# EAGLE design mother_board (EAGLE 5.11)
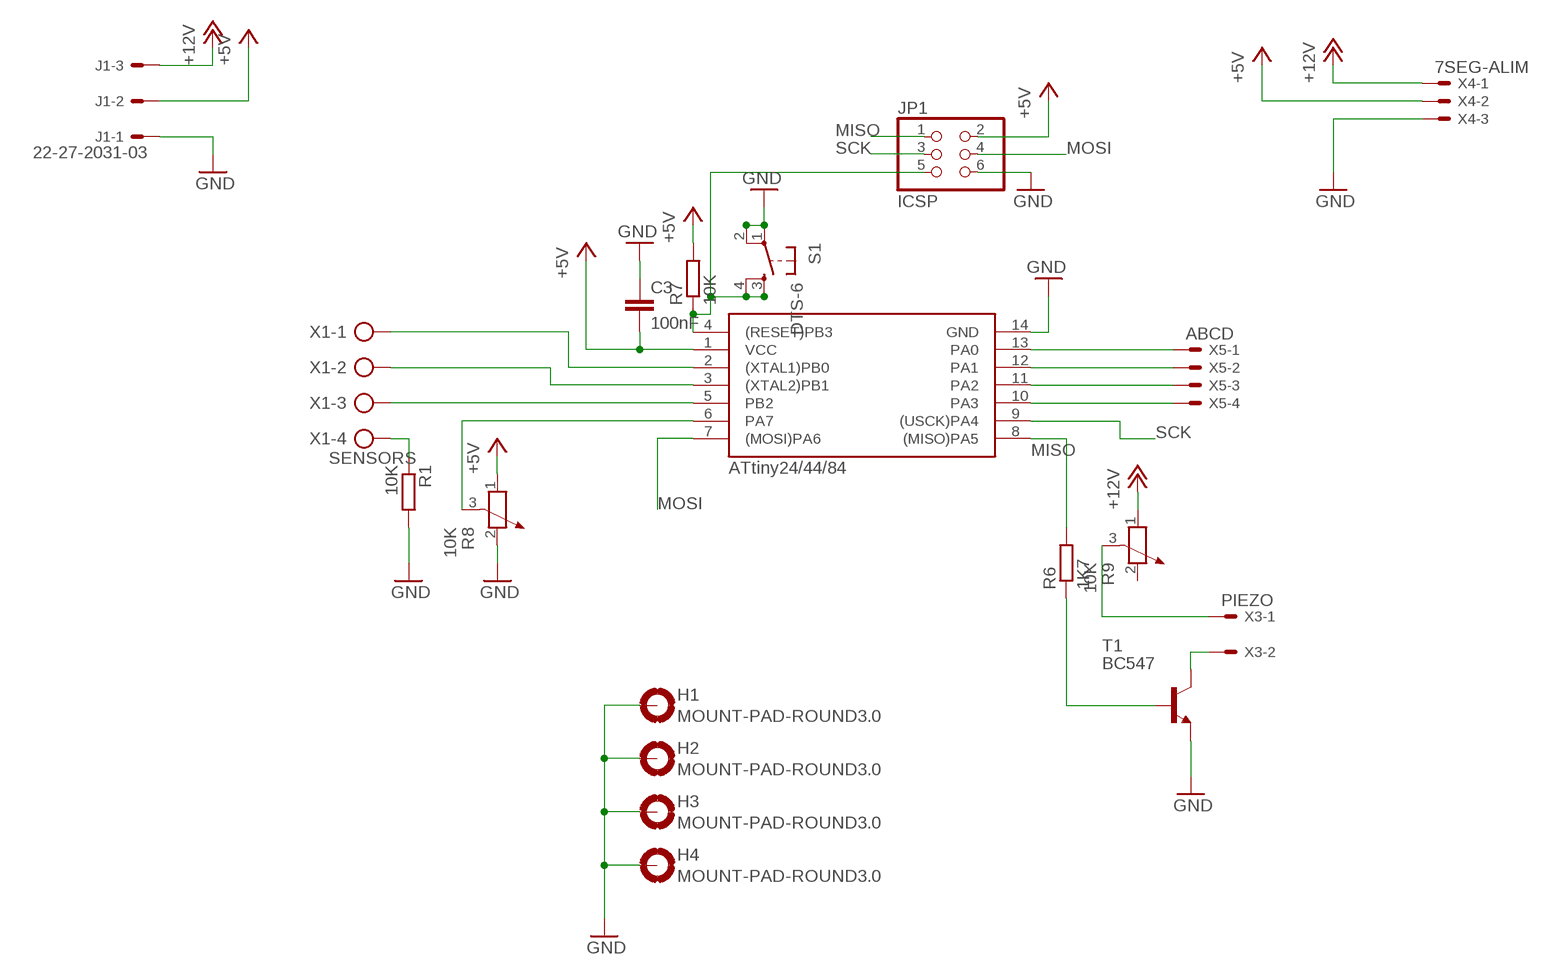
[diagram p0: schematic, sheet 1]

## Parts
C3  100nF  C-EU025-025X050  [C025-025X050]
H1  MOUNT-PAD-ROUND3.0  [3,0-PAD]
H2  MOUNT-PAD-ROUND3.0  [3,0-PAD]
H3  MOUNT-PAD-ROUND3.0  [3,0-PAD]
H4  MOUNT-PAD-ROUND3.0  [3,0-PAD]
J1  22-27-2031-03  [6410-03]
JP1  ICSP  PINHD-2X3  [2X03]
R1  10K  R-EU_0207/10  [0207/10]
R6  1K7  R-EU_0207/10  [0207/10]
R7  10K  R-EU_0207/10  [0207/10]
R8  10K  POTENTIOMETER_PT-10  [PT-10]
R9  10K  POTENTIOMETER_PT-10  [PT-10]
S1  DTS-6  [DTS-6]
T1  BC547  [TO92]
U$1  TINY24/44/84  [DIL14]
X1  SENSORS  AK500/4  [AK500/4]
X3  PIEZO  22-27-2021-02  [6410-02]
X4  7SEG-ALIM  22-27-2031-03  [6410-03]
X5  ABCD  22-27-2041-04  [6410-04]

## Nets
+5V [alim]: C3.2 J1.2 JP1.2 R7.2 R8.1 U$1.1(VCC) X4.2
+12V [alim]: J1.3 R9.1 X4.1
GND [alim]: C3.1 H1.B3,0(MOUNT) H2.B3,0(MOUNT) H3.B3,0(MOUNT) H4.B3,0(MOUNT) J1.1 JP1.6 R1.2 R8.2 S1.1 S1.2 T1.1(E) U$1.14(GND) X4.3
MISO: JP1.1 R6.2 U$1.8((MISO)PA5)
MOSI: JP1.4 U$1.7((MOSI)PA6)
N$1: R9.3 X3.1
N$2: R8.3 U$1.6(PA7)
N$3: U$1.5(PB2) X1.3
N$4: R1.1 X1.4
N$7: U$1.2((XTAL1)PB0) X1.1
N$8: R6.1 T1.2(B)
N$9: T1.3(C) X3.2
N$11: U$1.3((XTAL2)PB1) X1.2
N$12: U$1.13(PA0) X5.1
N$13: U$1.12(PA1) X5.2
N$14: U$1.11(PA2) X5.3
N$15: U$1.10(PA3) X5.4
N$20: JP1.5 R7.1 S1.3 S1.4 U$1.4((RESET)PB3)
SCK: JP1.3 U$1.9((USCK)PA4)
Unconnected: R9.2

## Library data of the parts
C3 = rcl:C-EU: CAPACITOR, European symbol
H1-H4 = holes:MOUNT-PAD-ROUND: MOUNTING PAD, round
J1 X4 = con-molex:22-?-03: CONNECTOR wire to board 2.54 mm (.1 inch) pitch header; OC_FARNELL: unknown; OC_NEWARK: unknown
JP1 = pinhead:PINHD-2X3: PIN HEADER
R1 R6 R7 = resistor:R-EU_: RESISTOR, European symbol
R8 R9 = rcl:POTENTIOMETER_: Potentiometer
S1 = switch-tact:DTS-6
T1 = transistor:BC547: NPN TRANSISTOR
U$1 = atmel_misc:TINY24/44/84
X1 = con-ptr500:AK500/4: CONNECTOR; OC_FARNELL: unknown; OC_NEWARK: unknown
X3 = con-molex:22-?-02: CONNECTOR wire to board 2.54 mm (.1 inch) pitch header; OC_FARNELL: unknown; OC_NEWARK: unknown
X5 = con-molex:22-?-04: CONNECTOR wire to board 2.54 mm (.1 inch) pitch header; OC_FARNELL: unknown; OC_NEWARK: unknown

## Net classes
0 default: width 0.813 mm
1 alim: width 1.27 mm

## Board
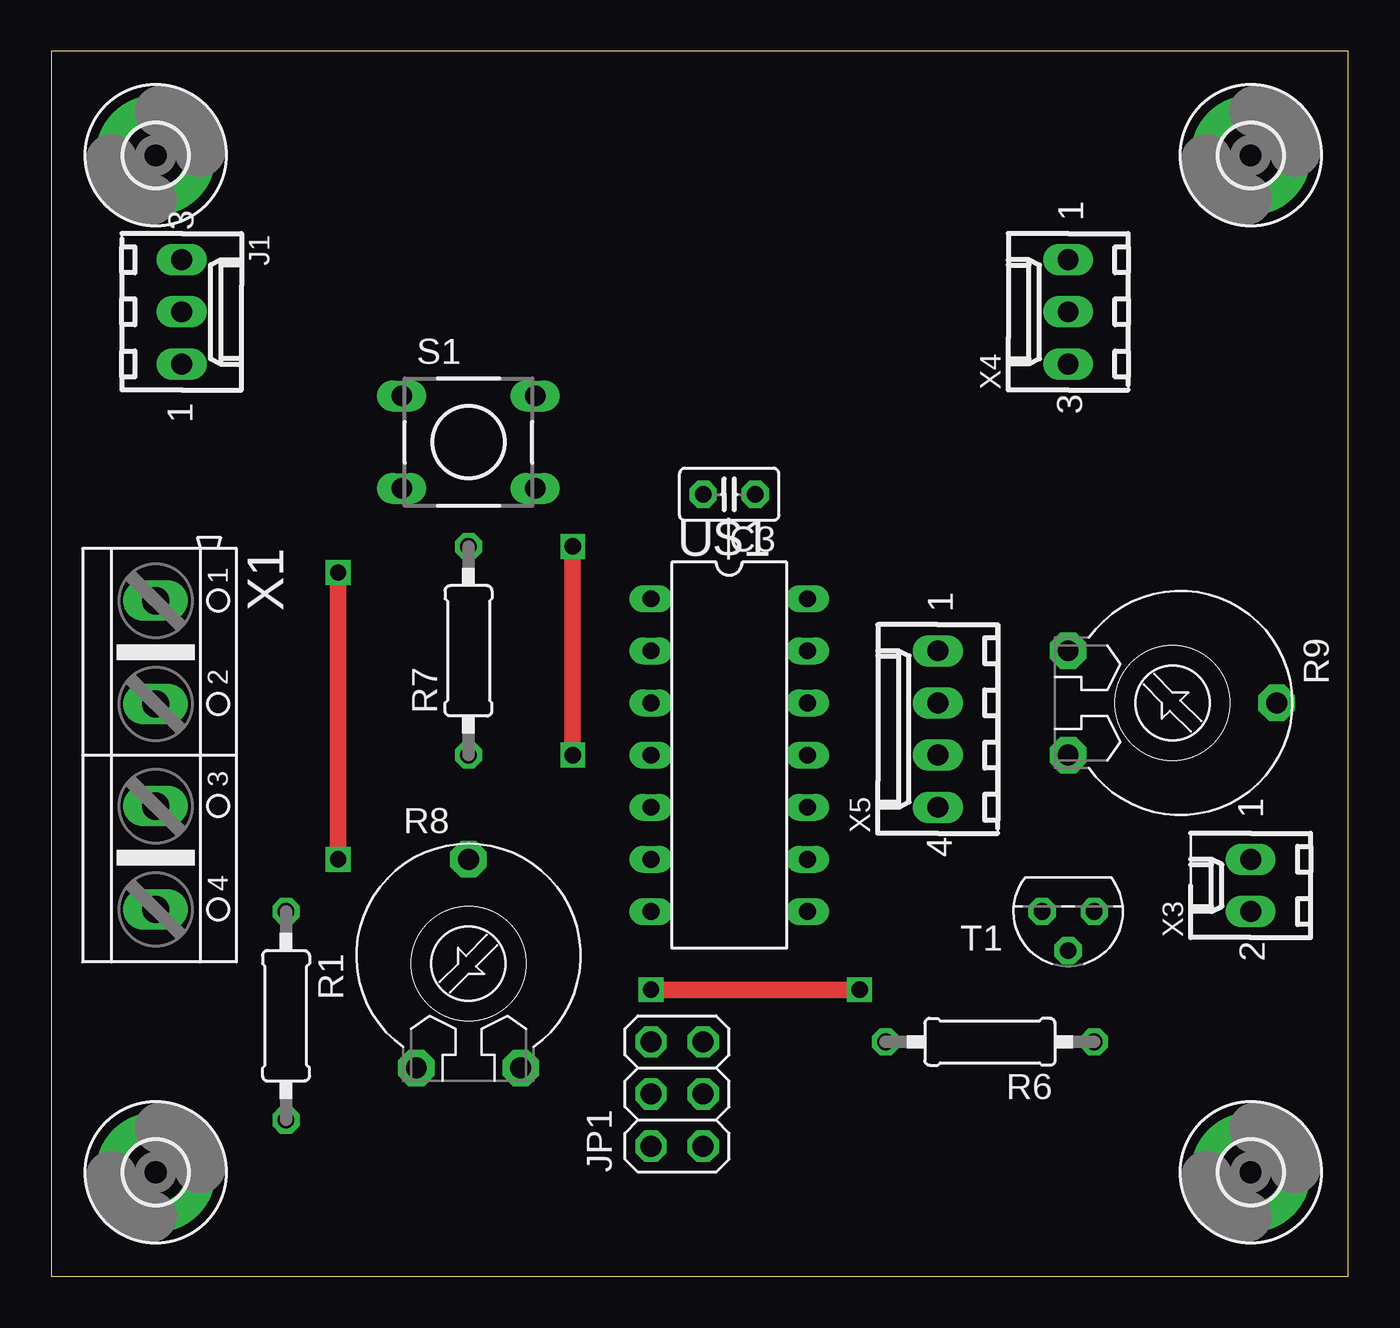
[diagram p1: board, top side]
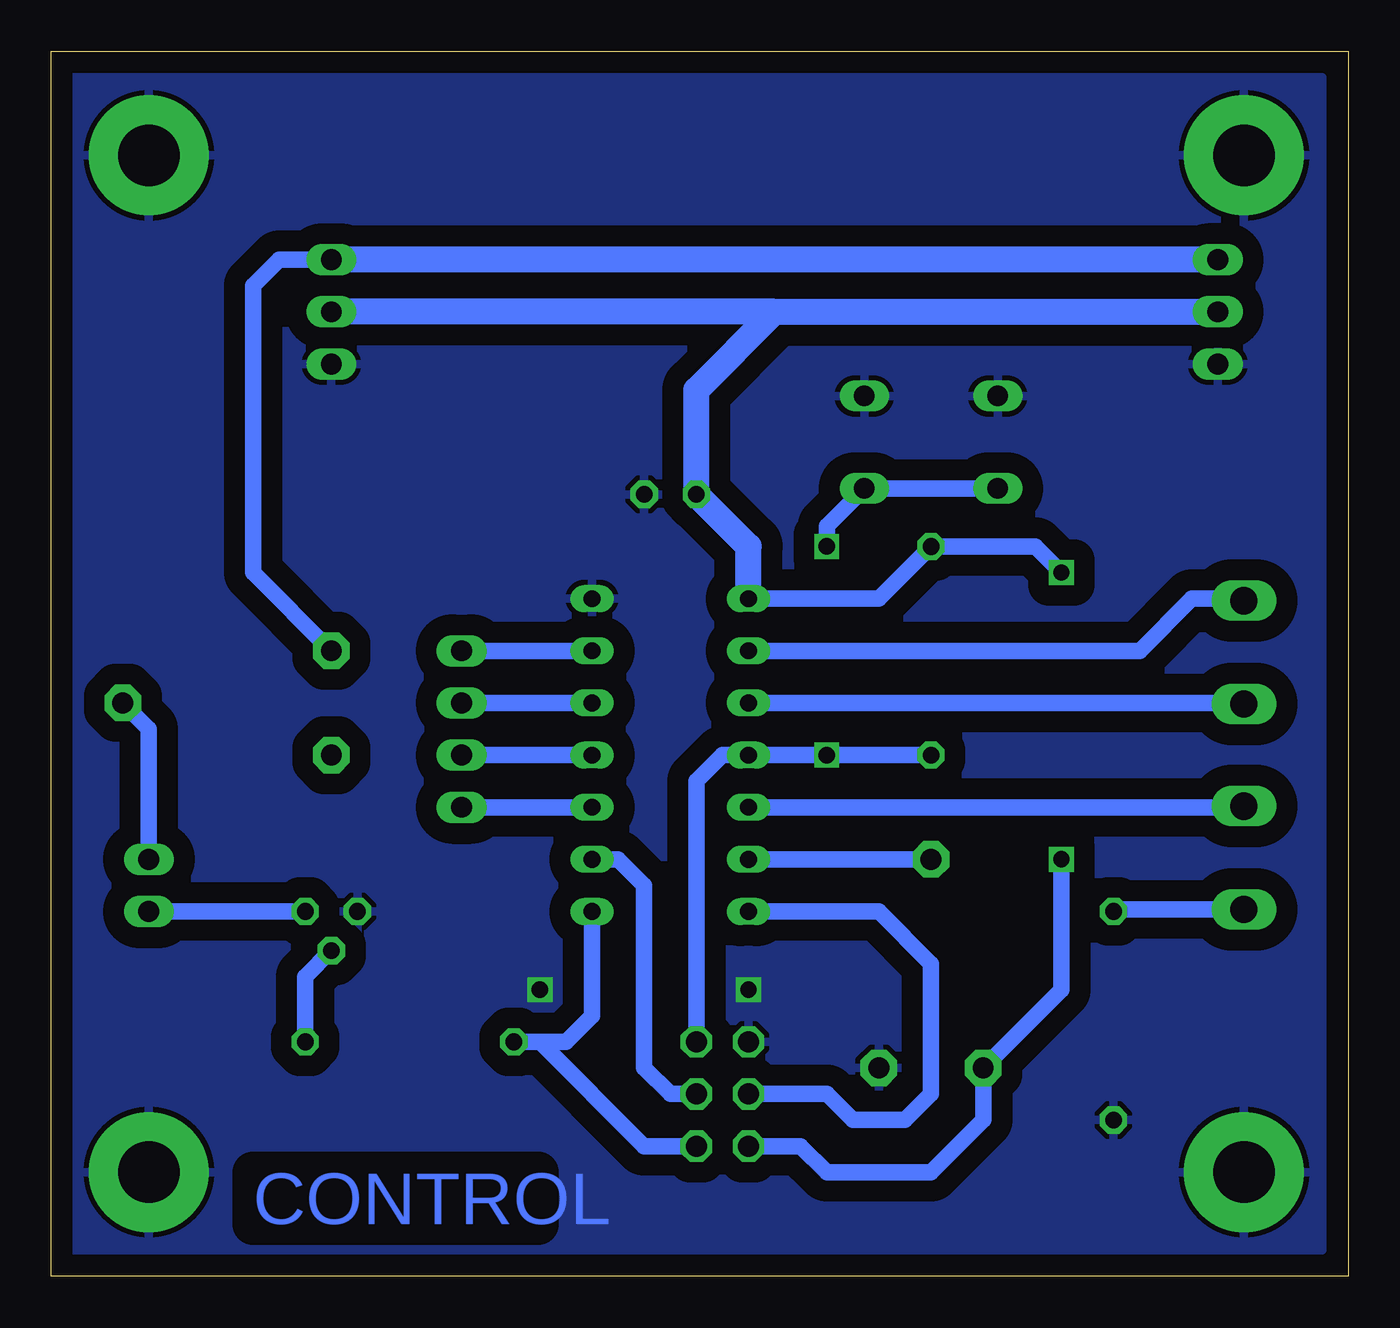
[diagram p2: board, bottom side, seen from below]

Size 63.17 x 59.68 mm. Coordinates in mm from the lower left corner, seen from the top.
Outline: 0,0 63.17,0 63.17,59.68 0,59.68 0,0
Copper layers (1*16): Top 0.035mm / dielectric 1.5mm / Bottom 0.035mm
Design rules "default *": minimum track width 10mil, minimum drill 24mil, track to track 8mil, track to pad 8mil, pad to pad 8mil, via to via 8mil, smd to smd 8mil, copper to edge 40mil, drill to drill 8mil, minimum pad ring 10mil, minimum via ring 8mil, stop-mask expansion 4mil, vias tented up to drill 0mil, thermal gap 10mil

### Footprints (pad centres in the part's own frame; a part is rotated, then mirrored left to right if it is on the bottom)
C025-025X050 = drill 0.813 octagon: 1 -1.27,0; 2 1.27,0
3,0-PAD = drill 3 pad 5.842 round: B3,0 0,0
6410-03 = drill 1.016 long: 1 2.54,0; 2 0,0; 3 -2.54,0
2X03 = drill 1.016 octagon: 1 -2.54,-1.27; 2 -2.54,1.27; 3 0,-1.27; 4 0,1.27; 5 2.54,-1.27; 6 2.54,1.27
0207/10 = drill 0.813 octagon: 1 -5.08,0; 2 5.08,0
PT-10 = drill 1.016 pad 1.778 octagon: 1 -2.54,-5.08; 2 2.54,-5.08; 3 0,5.08
DTS-6 = drill 1 long: 1 -3.25,2.25; 2 3.25,2.25; 3 -3.25,-2.25; 4 3.25,-2.25
TO92 = drill 0.813 octagon: 1 1.27,0; 2 0,1.905; 3 -1.27,0
DIL14 = drill 0.813 long: 1 -11.43,-3.81; 2 -8.89,-3.81; 3 -6.35,-3.81; 4 -3.81,-3.81; 5 -1.27,-3.81; 6 1.27,-3.81; 7 3.81,-3.81; 8 3.81,3.81; 9 1.27,3.81; 10 -1.27,3.81; 11 -3.81,3.81; 12 -6.35,3.81; 13 -8.89,3.81; 14 -11.43,3.81
AK500/4 = drill 1.321 long: 1 -7.518,0; 2 -2.489,0; 3 2.489,0; 4 7.518,0
6410-02 = drill 1.016 long: 1 1.27,0; 2 -1.27,0
6410-04 = drill 1.016 long: 1 3.81,0; 2 1.27,0; 3 -1.27,0; 4 -3.81,0

### Placement (x,y rotation side)
C3  33.02,38.1 180 top
H1  58.42,5.08 0 top
H2  58.42,54.61 0 top
H3  5.08,54.61 0 top
H4  5.08,5.08 0 top
J1  6.35,46.99 270 top
JP1  30.48,8.89 90 top
R1  11.43,12.7 270 top
R6  45.72,11.43 180 top
R7  20.32,30.48 90 top
R8  20.32,15.24 0 top
R9  54.61,27.94 270 top
S1  20.32,40.64 0 top
T1  49.53,17.78 180 top
U$1  33.02,21.59 270 top
X1  5.08,25.4 270 top
X3  58.42,19.05 90 top
X4  49.53,46.99 90 top
X5  43.18,26.67 90 top

### Tracks (layer width: path | path; a pad name or v marks a point on that pad's centre or on a via)
+5V  (via drill 0.8)
  Top 0.813: v13.97,20.32 v13.97,34.29
  Bottom 0.813: U$1.1 22.86,33.02 R7.2 15.24,35.56 v13.97,34.29 | JP1.2 26.67,6.35 25.4,5.08 20.32,5.08 17.78,7.62 R8.1 13.97,13.97 v13.97,20.32
  Bottom 1.27: U$1.1 29.21,35.56 C3.2 31.75,43.18 27.94,46.99 | 27.94,46.99 J1.2 | 27.94,46.99 X4.2
+12V
  Bottom 0.813: X4.1 52.07,49.53 53.34,48.26 53.34,34.29 R9.1
  Bottom 1.27: J1.3 X4.1
GND  (via drill 0.8)
  Top 0.813: v29.21,13.97 v39.37,13.97
  pour Bottom (isolate 1.016): 1.27,1.27 1.27,58.42 62.23,58.42 62.23,1.27
MISO
  Bottom 0.813: U$1.8 36.83,12.7 38.1,11.43 R6.2 39.37,11.43 34.29,6.35 JP1.1
MOSI
  Bottom 0.813: JP1.4 25.4,8.89 24.13,7.62 21.59,7.62 20.32,8.89 20.32,15.24 22.86,17.78 U$1.7
N$1
  Bottom 0.813: X3.1 58.42,26.67 R9.3
N$2
  Bottom 0.813: R8.3 U$1.6
N$3
  Bottom 0.813: U$1.5 5.13,22.86 X1.3
N$4
  Bottom 0.813: X1.4 11.33,17.88 R1.1
N$7
  Bottom 0.813: U$1.2 10.16,30.48 7.62,33.02 6.45,33.02 X1.1
N$8
  Bottom 0.813: R6.1 50.8,14.6 T1.2
N$9
  Bottom 0.813: T1.3 X3.2
N$11
  Bottom 0.813: U$1.3 5.13,27.94 X1.2
N$12
  Bottom 0.813: U$1.13 X5.1
N$13
  Bottom 0.813: U$1.12 X5.2
N$14
  Bottom 0.813: U$1.11 X5.3
N$15
  Bottom 0.813: U$1.10 X5.4
N$20  (via drill 0.8)
  Top 0.813: v25.4,25.4 v25.4,35.56
  Bottom 0.813: JP1.5 31.75,24.13 30.48,25.4 U$1.4 v25.4,25.4 R7.1 | v25.4,35.56 25.4,36.56 S1.4 S1.3
SCK
  Bottom 0.813: U$1.9 35.56,20.32 34.29,19.05 34.29,10.16 33.02,8.89 JP1.3

### Text on the board
Bottom: CONTROL